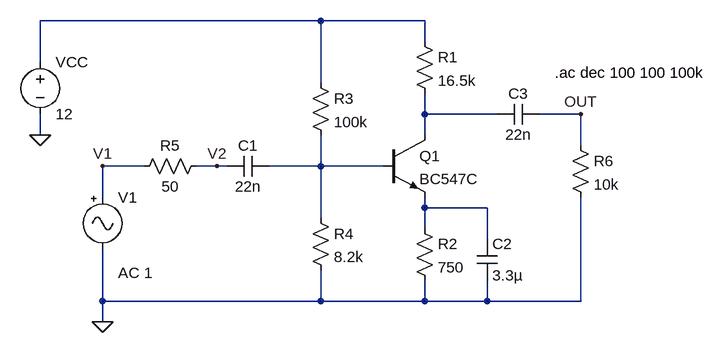
[diagram p0: schematic Sim_AmplificadorEj2.asc]
Sim_AmplificadorEj2.asc, the LTspice schematic file:
Version 4
SHEET 1 880 680
WIRE 80 -48 -352 -48
WIRE 240 -48 80 -48
WIRE 240 -16 240 -48
WIRE -352 16 -352 -48
WIRE 80 48 80 -48
WIRE 240 96 240 64
WIRE 352 96 240 96
WIRE 480 96 416 96
WIRE -352 128 -352 96
WIRE 240 128 240 96
WIRE 480 144 480 96
WIRE -192 176 -256 176
WIRE -80 176 -112 176
WIRE -64 176 -80 176
WIRE 80 176 80 128
WIRE 80 176 0 176
WIRE 176 176 80 176
WIRE -256 224 -256 176
WIRE 240 240 240 224
WIRE 336 240 240 240
WIRE 80 256 80 176
WIRE 240 272 240 240
WIRE 336 288 336 240
WIRE -256 384 -256 304
WIRE 80 384 80 336
WIRE 80 384 -256 384
WIRE 240 384 240 352
WIRE 240 384 80 384
WIRE 336 384 336 352
WIRE 336 384 240 384
WIRE 480 384 480 224
WIRE 480 384 336 384
WIRE -256 416 -256 384
FLAG -256 416 0
FLAG -352 128 0
FLAG 480 96 OUT
FLAG -256 176 V1
FLAG -80 176 V2
SYMBOL npn 176 128 R0
SYMATTR InstName Q1
SYMATTR Value BC547C
SYMBOL res 224 -32 R0
SYMATTR InstName R1
SYMATTR Value 16.5k
SYMBOL res 224 256 R0
SYMATTR InstName R2
SYMATTR Value 750
SYMBOL res 64 32 R0
SYMATTR InstName R3
SYMATTR Value 100k
SYMBOL res 64 240 R0
SYMATTR InstName R4
SYMATTR Value 8.2k
SYMBOL cap 0 160 R90
WINDOW 0 0 32 VBottom 2
WINDOW 3 32 32 VTop 2
SYMATTR InstName C1
SYMATTR Value 22n
SYMBOL res -96 160 R90
WINDOW 0 0 56 VBottom 2
WINDOW 3 32 56 VTop 2
SYMATTR InstName R5
SYMATTR Value 50
SYMBOL cap 320 288 R0
SYMATTR InstName C2
SYMATTR Value 3.3µ
SYMBOL cap 416 80 R90
WINDOW 0 0 32 VBottom 2
WINDOW 3 32 32 VTop 2
SYMATTR InstName C3
SYMATTR Value 22n
SYMBOL res 464 128 R0
SYMATTR InstName R6
SYMATTR Value 10k
SYMBOL voltage -352 0 R0
WINDOW 123 0 0 Left 2
WINDOW 39 0 0 Left 2
SYMATTR InstName VCC
SYMATTR Value 12
SYMBOL Misc\\signal -256 208 R0
WINDOW 123 24 132 Left 2
WINDOW 39 0 0 Left 2
SYMATTR Value2 AC 1
SYMATTR InstName V1
SYMATTR Value ""
TEXT 440 32 Left 2 !.ac dec 100 100 100k

The netlist it stands for:
* Sim_AmplificadorEj2.asc
Q1 N002 N003 N004 0 BC547C
R1 N001 N002 16.5k
R2 N004 0 750
R3 N001 N003 100k
R4 N003 0 8.2k
C1 N003 V2 22n
R5 V2 V1 50
C2 N004 0 3.3µ
C3 OUT N002 22n
R6 OUT 0 10k
VCC N001 0 12
V1 V1 0 AC 1
.model NPN NPN
.model PNP PNP
.lib standard.bjt
.ac dec 100 100 100k
.backanno
.end